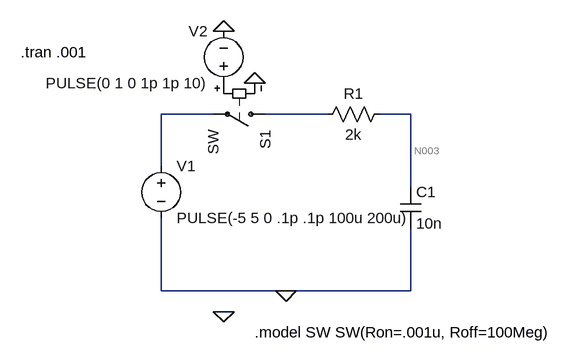
[diagram p0: schematic Circuit3.asc]
Circuit3.asc, the LTspice schematic file:
Version 4.1
SHEET 1 880 680
WIRE 192 48 112 48
WIRE 368 48 272 48
WIRE 496 48 448 48
WIRE 112 128 112 48
WIRE 496 160 496 48
WIRE 112 320 112 208
WIRE 304 320 112 320
WIRE 496 320 496 224
WIRE 496 320 304 320
FLAG 208 -80 0
FLAG 256 0 0
FLAG 304 320 0
FLAG 208 352 0
SYMBOL voltage 112 112 R0
WINDOW 123 0 0 Left 0
WINDOW 39 0 0 Left 0
SYMATTR InstName V1
SYMATTR Value PULSE(-5 5 0 .1p .1p 100u 200u)
SYMBOL sw 288 48 R90
SYMATTR InstName S1
SYMBOL res 464 32 R90
WINDOW 0 0 56 VBottom 2
WINDOW 3 32 56 VTop 2
SYMATTR InstName R1
SYMATTR Value 2k
SYMBOL cap 480 160 R0
SYMATTR InstName C1
SYMATTR Value 10n
SYMBOL voltage 208 16 R180
WINDOW 0 24 96 Left 2
WINDOW 3 24 16 Left 2
WINDOW 123 0 0 Left 0
WINDOW 39 0 0 Left 0
SYMATTR InstName V2
SYMATTR Value PULSE(0 1 0 1p 1p 10)
TEXT 256 384 Left 2 !.model SW SW(Ron=.001u, Roff=100Meg)
TEXT -104 -48 Left 2 !.tran .001

The netlist it stands for:
* Circuit3.asc
V1 N001 0 PULSE(-5 5 0 .1p .1p 100u 200u)
S1 N002 N001 P001 0 SW
R1 N003 N002 2k
C1 N003 0 10n
V2 P001 0 PULSE(0 1 0 1p 1p 10)
.model SW SW(Ron=.001u, Roff=100Meg)
.tran .001
.backanno
.end

* Results of the author's LTspice run, read from the files saved beside the schematic
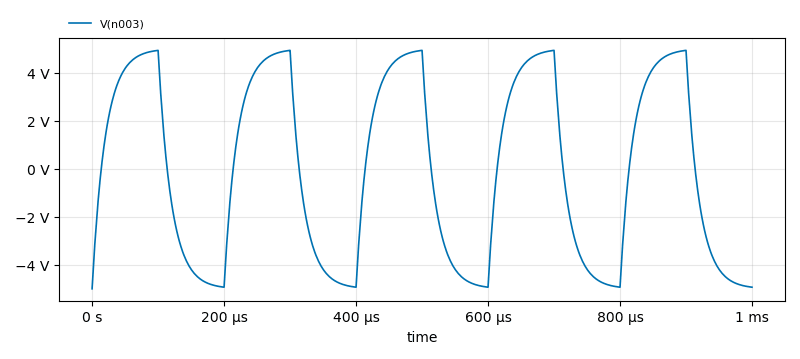
[diagram p1: Transient Analysis of Circuit3.asc, plotted from the saved traces]
* Transient Analysis, 1 run:
*   V(n003): min -5 V, max 4.933 V, average -1.372 mV, rms 3.897 V, last -4.933 V